# EAGLE schematic avr-remocon (EAGLE 8.3.1)
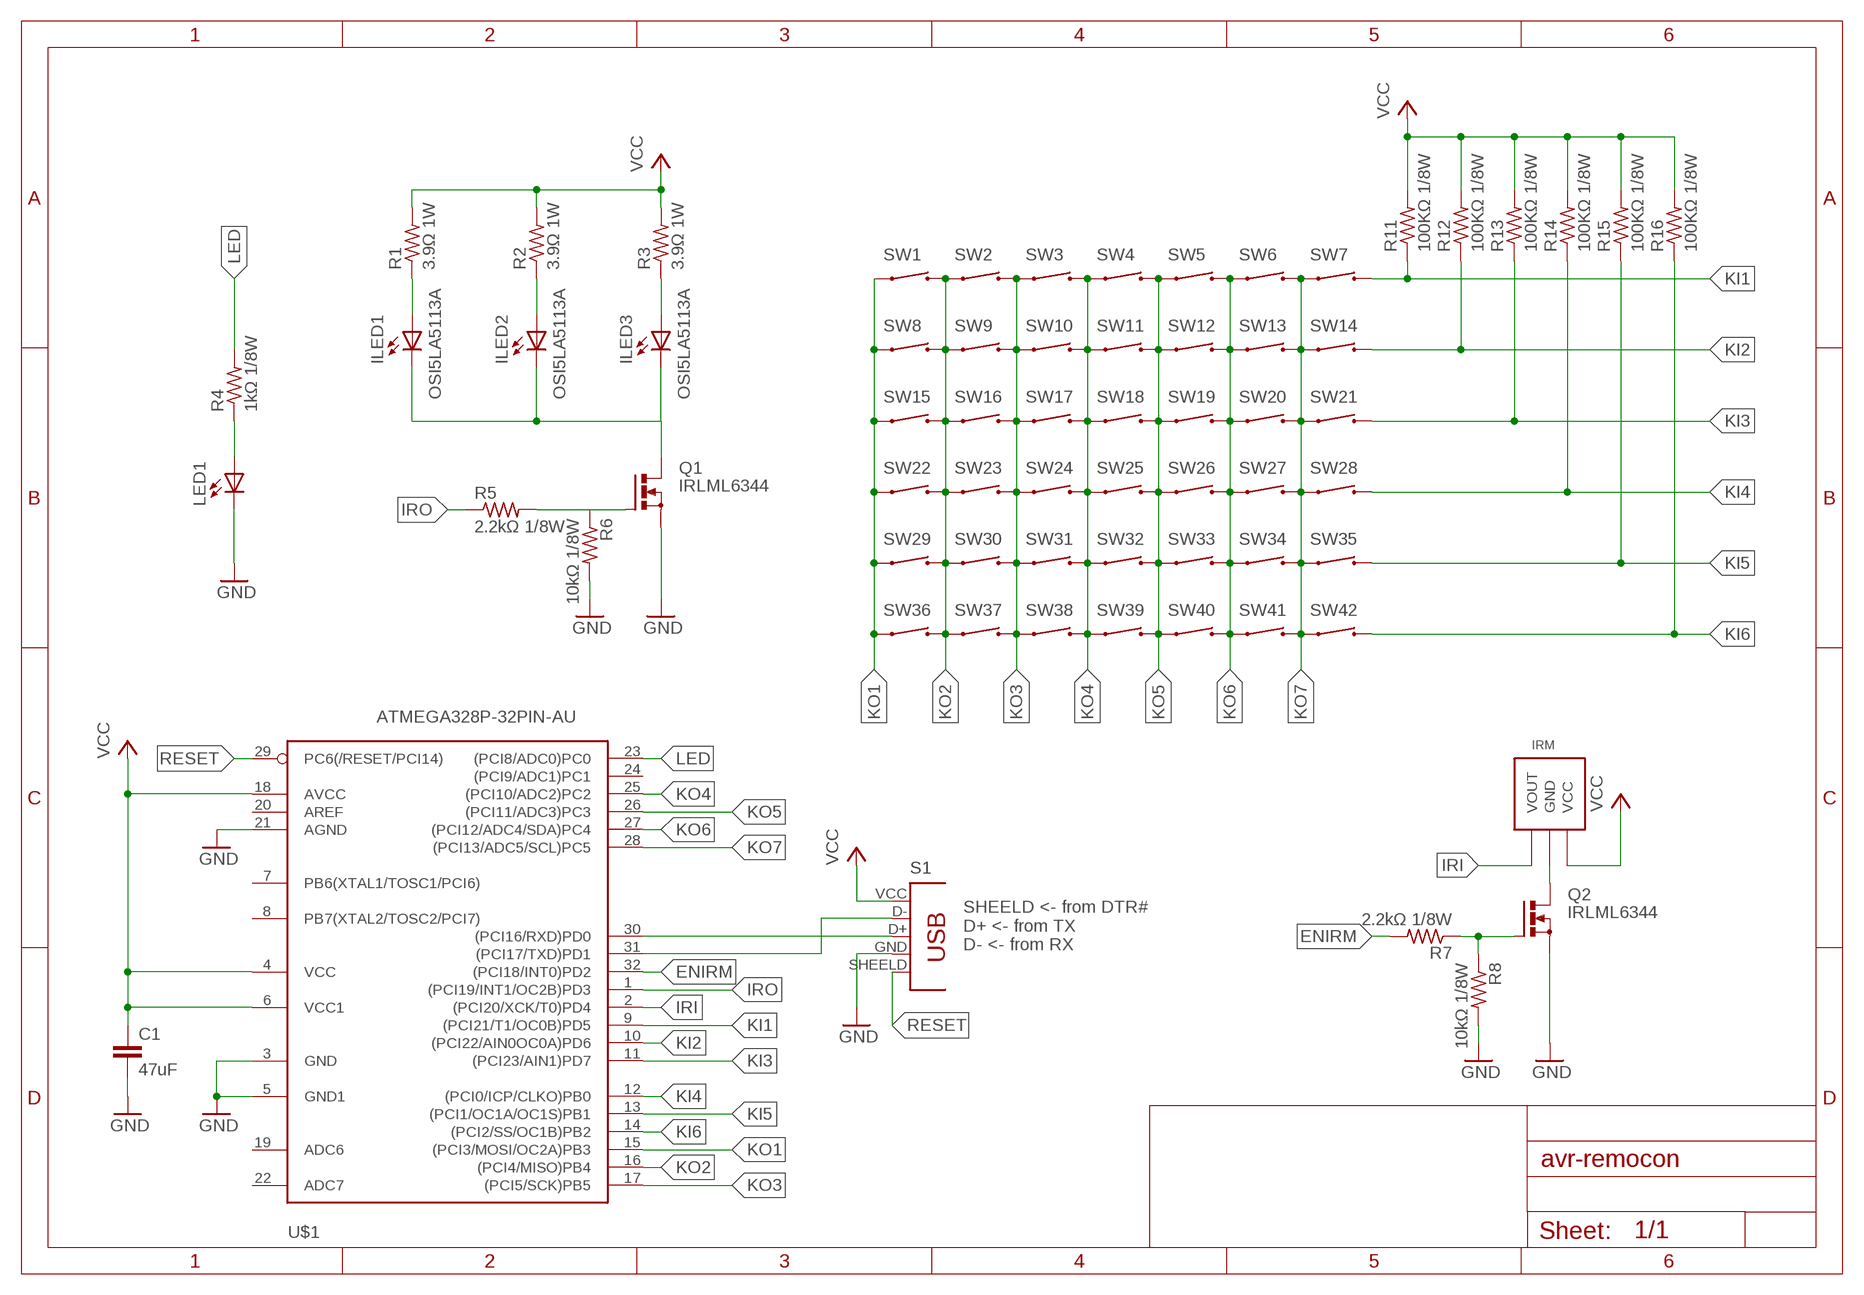
[diagram p0: schematic, sheet 1]

## Parts
C1  47uF  C-EUC3216  [C3216]
ILED1  OSI5LA5113A  LED-SIDEDOWN3  [LED5MM-SIDE-DOWN3]
ILED2  OSI5LA5113A  LED-SIDEDOWN3  [LED5MM-SIDE-DOWN3]
ILED3  OSI5LA5113A  LED-SIDEDOWN3  [LED5MM-SIDE-DOWN3]
IRM  IRM2161  [IRM2161]
LED1  LG_T679-E1F1-1  [PLCC2]
Q1  IRLML6344  [SOT-23]
Q2  IRLML6344  [SOT-23]
R1  3.9Ω 1W  R-US_R2512W  [R2512W]
R2  3.9Ω 1W  R-US_R2512W  [R2512W]
R3  3.9Ω 1W  R-US_R2512W  [R2512W]
R4  1kΩ 1/8W  R-US_R0805  [R0805]
R5  2.2kΩ 1/8W  R-US_R0805  [R0805]
R6  10kΩ 1/8W  R-US_R0805  [R0805]
R7  2.2kΩ 1/8W  R-US_R0805  [R0805]
R8  10kΩ 1/8W  R-US_R0805  [R0805]
R11  100KΩ 1/8W  R-US_R0805  [R0805]
R12  100KΩ 1/8W  R-US_R0805  [R0805]
R13  100KΩ 1/8W  R-US_R0805  [R0805]
R14  100KΩ 1/8W  R-US_R0805  [R0805]
R15  100KΩ 1/8W  R-US_R0805  [R0805]
R16  100KΩ 1/8W  R-US_R0805  [R0805]
S1  TYPE-A+SHILED-MALE  [TYPE-A-MALE]
SW1  RUBBER-SWITCH  [HALF-PITCH]
SW2  RUBBER-SWITCH  [HALF-PITCH]
SW3  RUBBER-SWITCH  [HALF-PITCH]
SW4  RUBBER-SWITCH  [HALF-PITCH]
SW5  RUBBER-SWITCH  [HALF-PITCH]
SW6  RUBBER-SWITCH  [HALF-PITCH]
SW7  RUBBER-SWITCH  [HALF-PITCH]
SW8  RUBBER-SWITCH  [HALF-PITCH]
SW9  RUBBER-SWITCH  [HALF-PITCH]
SW10  RUBBER-SWITCH  [HALF-PITCH]
SW11  RUBBER-SWITCH  [HALF-PITCH]
SW12  RUBBER-SWITCH  [HALF-PITCH]
SW13  RUBBER-SWITCH  [HALF-PITCH]
SW14  RUBBER-SWITCH  [HALF-PITCH]
SW15  RUBBER-SWITCH  [HALF-PITCH]
SW16  RUBBER-SWITCH  [HALF-PITCH]
SW17  RUBBER-SWITCH  [HALF-PITCH]
SW18  RUBBER-SWITCH  [HALF-PITCH]
SW19  RUBBER-SWITCH  [HALF-PITCH]
SW20  RUBBER-SWITCH  [HALF-PITCH]
SW21  RUBBER-SWITCH  [HALF-PITCH]
SW22  RUBBER-SWITCH  [HALF-PITCH]
SW23  RUBBER-SWITCH  [HALF-PITCH]
SW24  RUBBER-SWITCH  [HALF-PITCH]
SW25  RUBBER-SWITCH  [HALF-PITCH]
SW26  RUBBER-SWITCH  [HALF-PITCH]
SW27  RUBBER-SWITCH  [HALF-PITCH]
SW28  RUBBER-SWITCH  [HALF-PITCH]
SW29  RUBBER-SWITCH  [HALF-PITCH]
SW30  RUBBER-SWITCH  [HALF-PITCH]
SW31  RUBBER-SWITCH  [HALF-PITCH]
SW32  RUBBER-SWITCH  [HALF-PITCH]
SW33  RUBBER-SWITCH  [HALF-PITCH]
SW34  RUBBER-SWITCH  [HALF-PITCH]
SW35  RUBBER-SWITCH  [HALF-PITCH]
SW36  RUBBER-SWITCH  [HALF-PITCH]
SW37  RUBBER-SWITCH  [HALF-PITCH]
SW38  RUBBER-SWITCH  [HALF-PITCH]
SW39  RUBBER-SWITCH  [HALF-PITCH]
SW40  RUBBER-SWITCH  [HALF-PITCH]
SW41  RUBBER-SWITCH  [HALF-PITCH]
SW42  RUBBER-SWITCH  [HALF-PITCH]
U$1  ATMEGA328P-32PIN-AU  [TQFP32-08]

## Nets
ENIRM: R7.2 U$1.32((PCI18/INT0)PD2)
GND: C1.2 LED1.C Q1.P2(S) Q2.P2(S) R6.2 R8.2 S1.GND U$1.3(GND) U$1.5(GND1) U$1.21(AGND)
IRI: IRM.P$1(VOUT) U$1.2((PCI20/XCK/T0)PD4)
IRO: R5.1 U$1.1((PCI19/INT1/OC2B)PD3)
KI1: R11.1 SW7.P2 U$1.9((PCI21/T1/OC0B)PD5)
KI2: R12.1 SW14.P2 U$1.10((PCI22/AIN0OC0A)PD6)
KI3: R13.1 SW21.P2 U$1.11((PCI23/AIN1)PD7)
KI4: R14.1 SW28.P2 U$1.12((PCI0/ICP/CLKO)PB0)
KI5: R15.1 SW35.P2 U$1.13((PCI1/OC1A/OC1S)PB1)
KI6: R16.1 SW42.P2 U$1.14((PCI2/SS/OC1B)PB2)
KO1: SW1.P1 SW8.P1 SW15.P1 SW22.P1 SW29.P1 SW36.P1 U$1.15((PCI3/MOSI/OC2A)PB3)
KO2: SW1.P2 SW2.P1 SW8.P2 SW9.P1 SW15.P2 SW16.P1 SW22.P2 SW23.P1 SW29.P2 SW30.P1 SW36.P2 SW37.P1 U$1.16((PCI4/MISO)PB4)
KO3: SW2.P2 SW3.P1 SW9.P2 SW10.P1 SW16.P2 SW17.P1 SW23.P2 SW24.P1 SW30.P2 SW31.P1 SW37.P2 SW38.P1 U$1.17((PCI5/SCK)PB5)
KO4: SW3.P2 SW4.P1 SW10.P2 SW11.P1 SW17.P2 SW18.P1 SW24.P2 SW25.P1 SW31.P2 SW32.P1 SW38.P2 SW39.P1 U$1.25((PCI10/ADC2)PC2)
KO5: SW4.P2 SW5.P1 SW11.P2 SW12.P1 SW18.P2 SW19.P1 SW25.P2 SW26.P1 SW32.P2 SW33.P1 SW39.P2 SW40.P1 U$1.26((PCI11/ADC3)PC3)
KO6: SW5.P2 SW6.P1 SW12.P2 SW13.P1 SW19.P2 SW20.P1 SW26.P2 SW27.P1 SW33.P2 SW34.P1 SW40.P2 SW41.P1 U$1.27((PCI12/ADC4/SDA)PC4)
KO7: SW6.P2 SW7.P1 SW13.P2 SW14.P1 SW20.P2 SW21.P1 SW27.P2 SW28.P1 SW34.P2 SW35.P1 SW41.P2 SW42.P1 U$1.28((PCI13/ADC5/SCL)PC5)
LED: R4.2 U$1.23((PCI8/ADC0)PC0)
N$1: ILED1.K(C) ILED2.K(C) ILED3.K(C) Q1.P3(D)
N$2: IRM.P$2(GND) Q2.P3(D)
N$3: ILED1.A R1.1
N$4: Q1.P1(G) R5.2 R6.1
N$5: ILED2.A R2.1
N$7: ILED3.A R3.1
N$8: LED1.A R4.1
N$10: Q2.P1(G) R7.1 R8.1
N$12: S1.D+ U$1.30((PCI16/RXD)PD0)
N$16: S1.D- U$1.31((PCI17/TXD)PD1)
RESET: S1.SHEELD U$1.29(PC6(/RESET/PCI14))
VCC: C1.1 IRM.P$3(VCC) R1.2 R2.2 R3.2 R11.2 R12.2 R13.2 R14.2 R15.2 R16.2 S1.VCC U$1.4(VCC) U$1.6(VCC1) U$1.18(AVCC)
Unconnected: U$1.7(PB6(XTAL1/TOSC1/PCI6)) U$1.8(PB7(XTAL2/TOSC2/PCI7)) U$1.19(ADC6) U$1.20(AREF) U$1.22(ADC7) U$1.24((PCI9/ADC1)PC1)

## Notes on the sheet
- SHEELD <- from DTR#
  D+ <- from TX
  D- <- from RX

## Library data of the parts
C1 = rcl:C-EU: CAPACITOR, European symbol
ILED1-ILED3 = led-side:LED-SIDE
IRM = IRM2161:IRM2161
LED1 = led:*_T679-?-1: LC TOPLED® Low Current LED Source: http://catalog.osram-os.com .. LG_LS_LY_T679_OBS.pdf; COLOR: green
Q1 Q2 = mosfet:IRLML6344
R1-R8 R11-R16 = rcl:R-US_: RESISTOR, American symbol
S1 = usb-connector:TYPE-A+SHILED-MALE
SW1-SW42 = rubber-switch:RUBBER-SWITCH
U$1 = avr:ATMEGA328P-32PIN